# EAGLE schematic board (EAGLE 6.4)
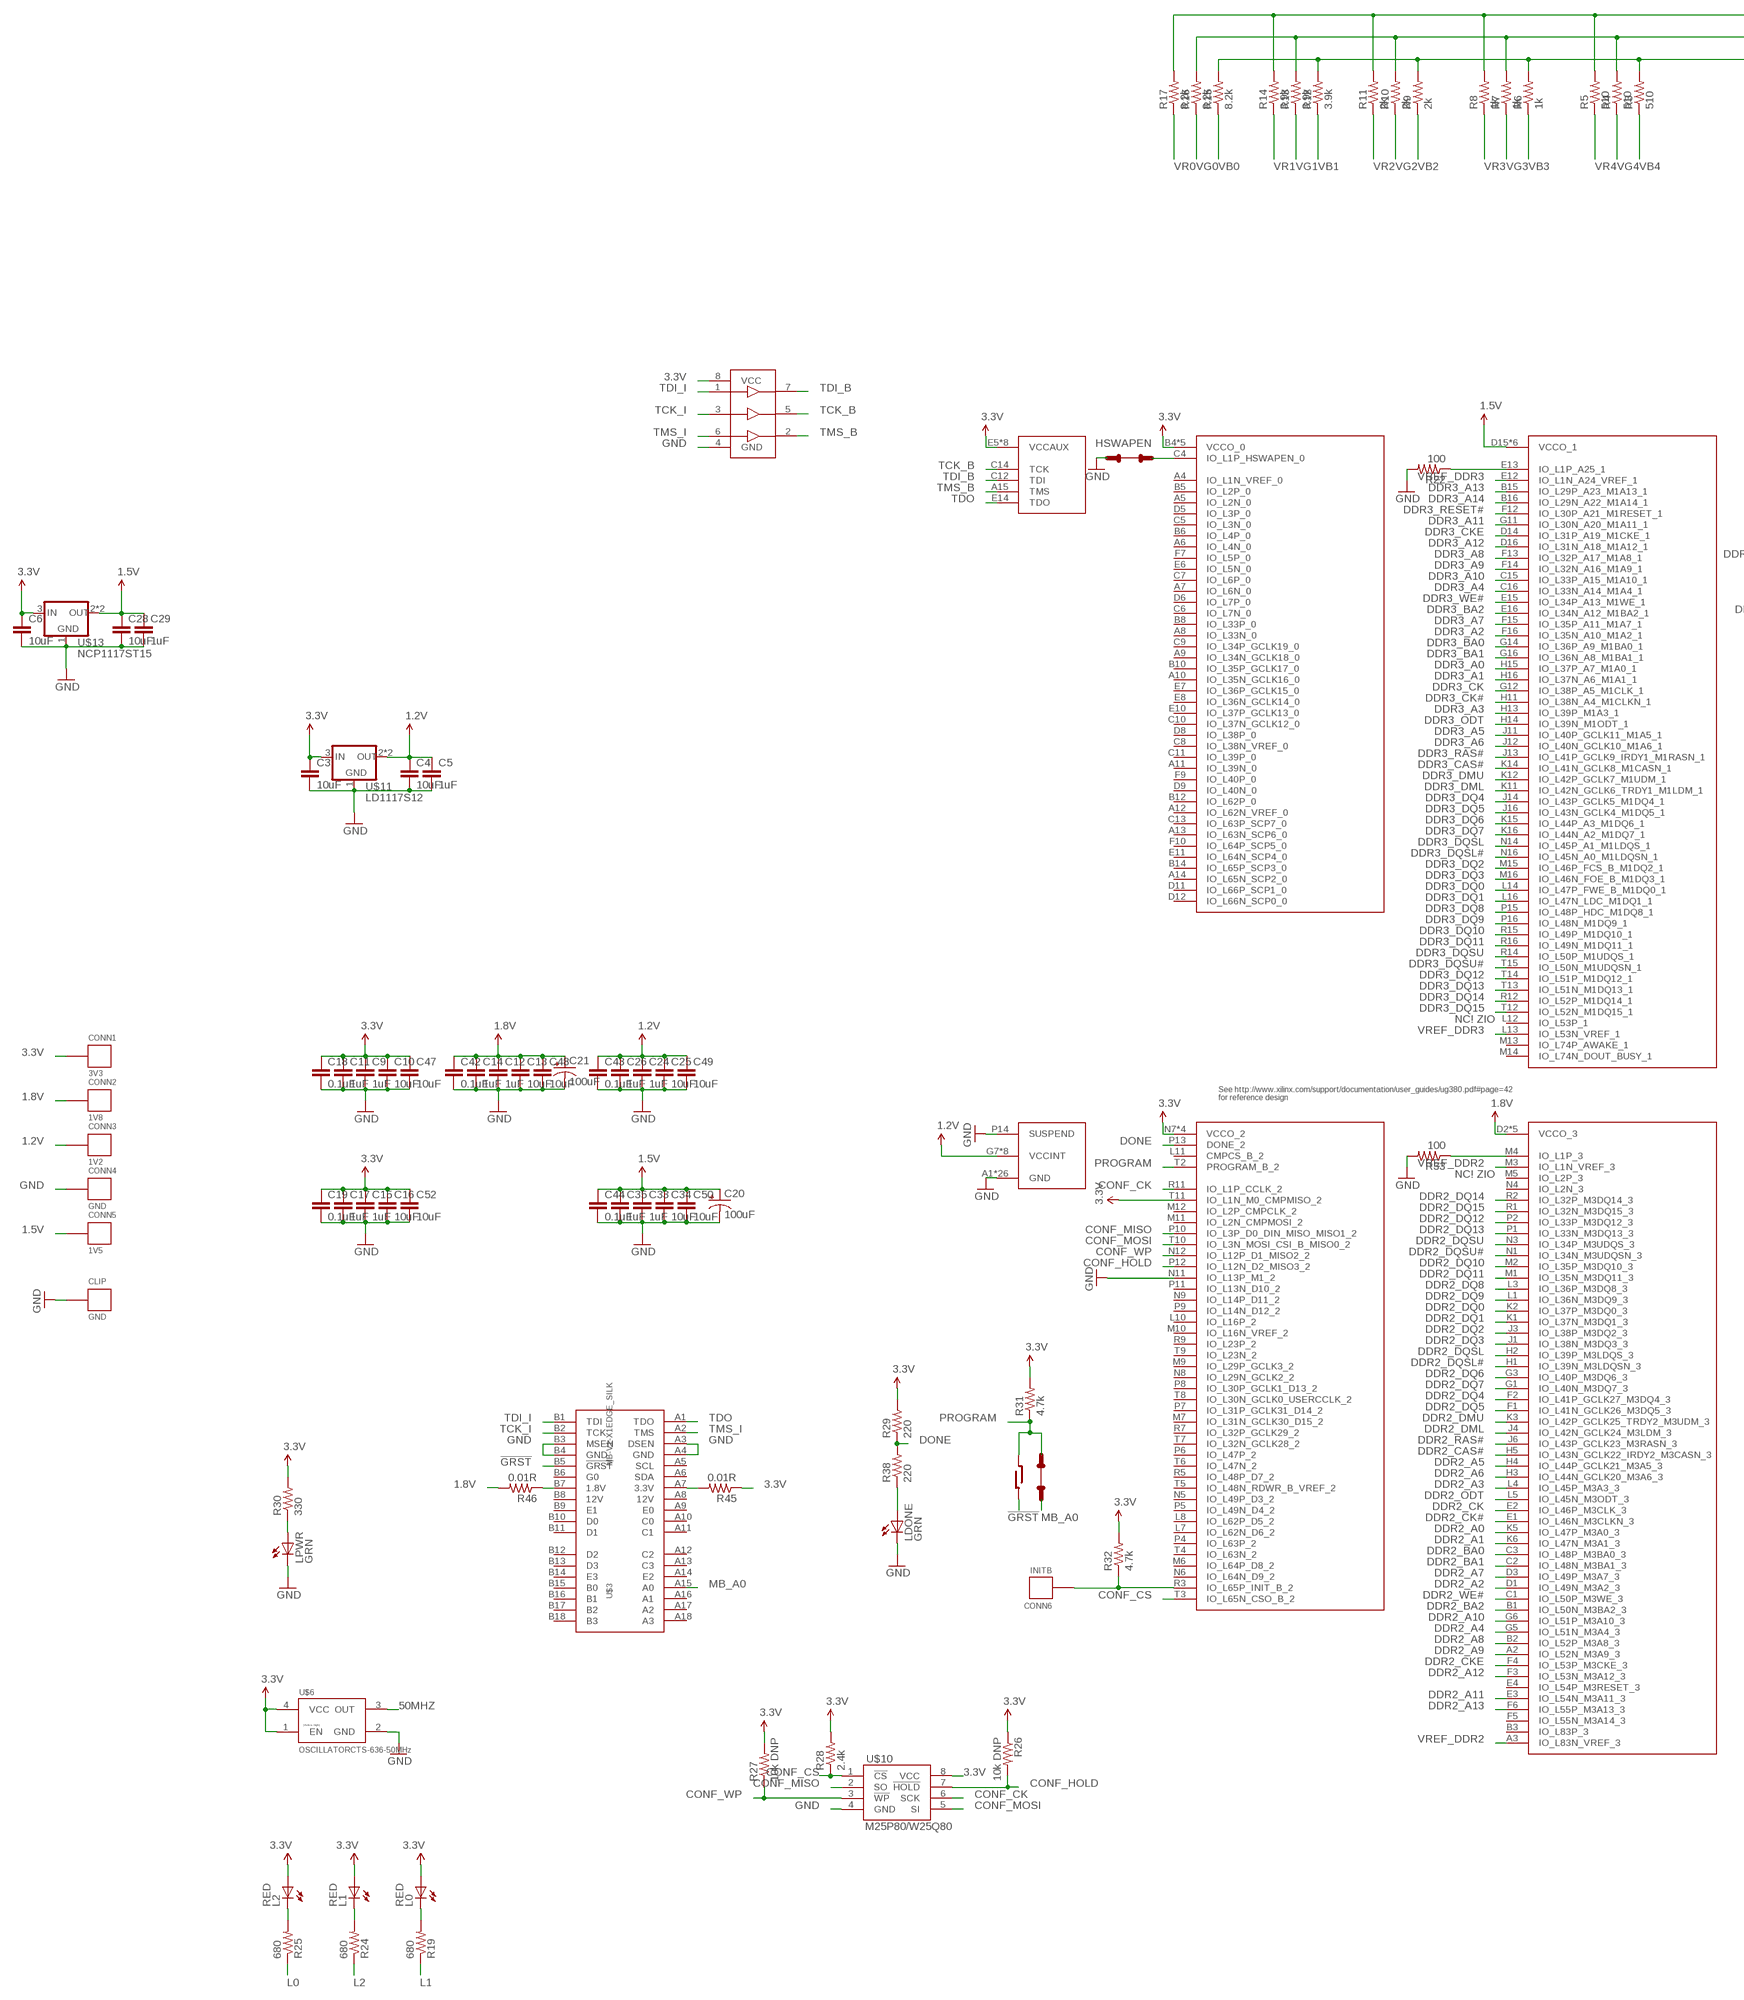
[diagram p0: schematic, sheet 1, part 1 of 2]
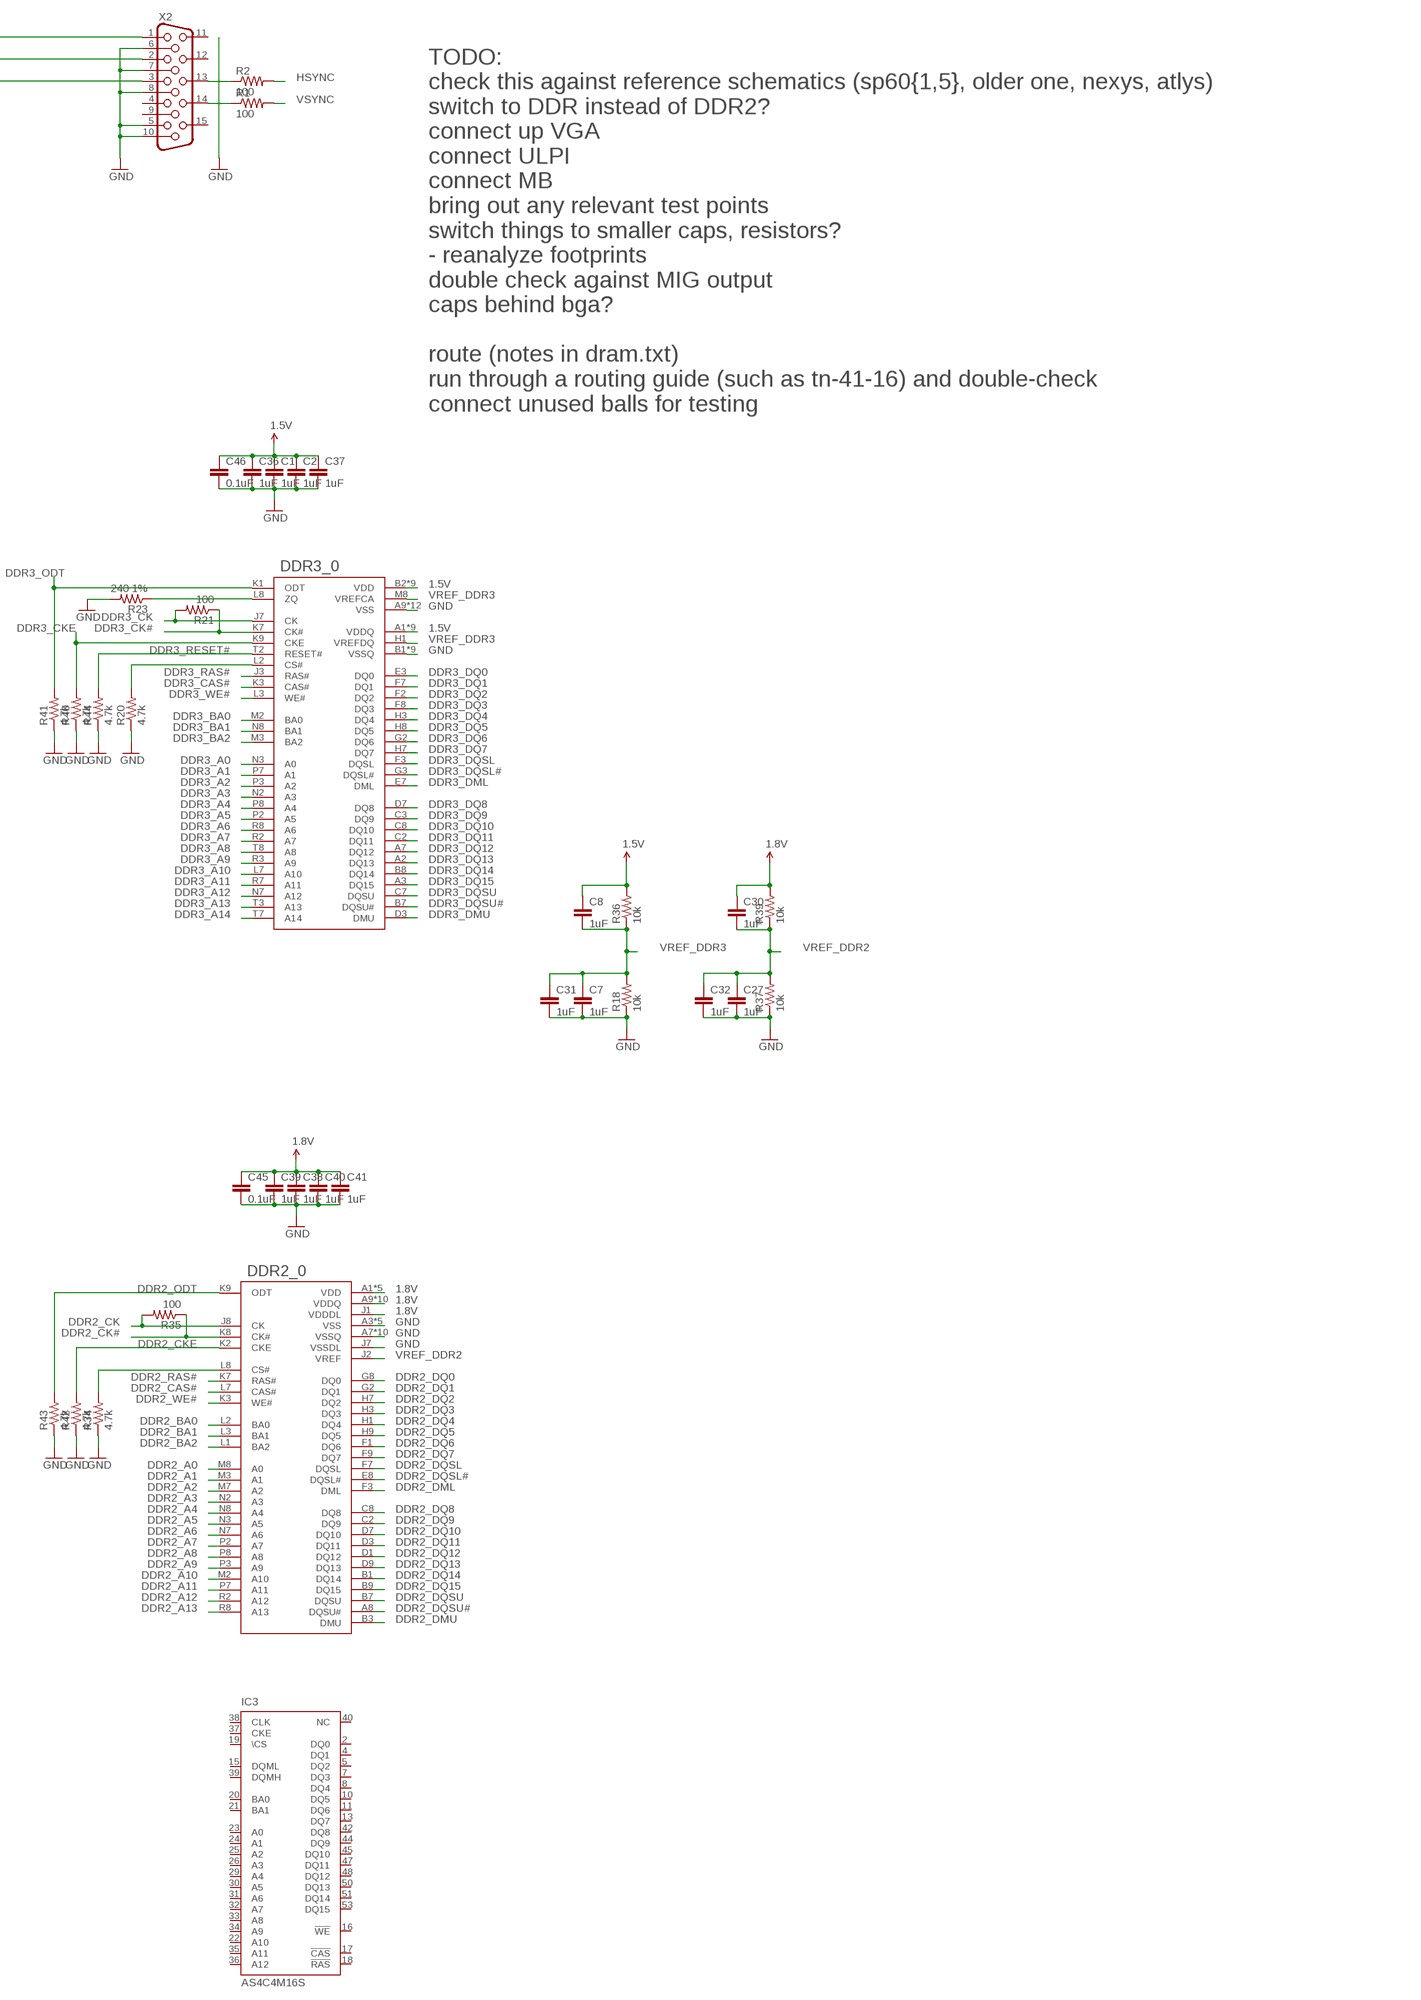
[diagram p1: schematic, sheet 1, part 2 of 2]

## Parts
C1  1uF  CAP0402-CAP  [0402-CAP]
C2  1uF  CAP0402-CAP  [0402-CAP]
C3  10uF  CAP0603  [0603-CAP]
C4  10uF  CAP0603  [0603-CAP]
C5  1uF  CAP0402-CAP  [0402-CAP]
C6  10uF  CAP0603  [0603-CAP]
C7  1uF  CAP0402-CAP  [0402-CAP]
C8  1uF  CAP0402-CAP  [0402-CAP]
C9  1uF  CAP0402-CAP  [0402-CAP]
C10  10uF  CAP0603  [0603-CAP]
C11  1uF  CAP0402-CAP  [0402-CAP]
C12  1uF  CAP0402-CAP  [0402-CAP]
C13  10uF  CAP0603  [0603-CAP]
C14  1uF  CAP0402-CAP  [0402-CAP]
C15  1uF  CAP0402-CAP  [0402-CAP]
C16  10uF  CAP0603  [0603-CAP]
C17  1uF  CAP0402-CAP  [0402-CAP]
C18  0.1uF  CAP0201  [C0201]
C19  0.1uF  CAP0201  [C0201]
C20  100uF  CAP_POLPTH-5-2  [CAP-5-2]
C21  100uF  CAP_POLPTH-5-2  [CAP-5-2]
C24  1uF  CAP0402-CAP  [0402-CAP]
C25  10uF  CAP0603  [0603-CAP]
C26  1uF  CAP0402-CAP  [0402-CAP]
C27  1uF  CAP0402-CAP  [0402-CAP]
C28  10uF  CAP0603  [0603-CAP]
C29  1uF  CAP0402-CAP  [0402-CAP]
C30  1uF  CAP0402-CAP  [0402-CAP]
C31  1uF  CAP0402-CAP  [0402-CAP]
C32  1uF  CAP0402-CAP  [0402-CAP]
C33  1uF  CAP0402-CAP  [0402-CAP]
C34  10uF  CAP0603  [0603-CAP]
C35  1uF  CAP0402-CAP  [0402-CAP]
C36  1uF  CAP0402-CAP  [0402-CAP]
C37  1uF  CAP0402-CAP  [0402-CAP]
C38  1uF  CAP0402-CAP  [0402-CAP]
C39  1uF  CAP0402-CAP  [0402-CAP]
C40  1uF  CAP0402-CAP  [0402-CAP]
C41  1uF  CAP0402-CAP  [0402-CAP]
C42  0.1uF  CAP0201  [C0201]
C43  0.1uF  CAP0201  [C0201]
C44  0.1uF  CAP0201  [C0201]
C45  0.1uF  CAP0201  [C0201]
C46  0.1uF  CAP0201  [C0201]
C47  10uF  CAP0603  [0603-CAP]
C48  10uF  CAP0603  [0603-CAP]
C49  10uF  CAP0603  [0603-CAP]
C50  10uF  CAP0603  [0603-CAP]
C52  10uF  CAP0603  [0603-CAP]
CLIP  GND  CONNECTORCLIP  [CLIP-AREA]
CONN1  3V3  CONNECTOR22AWG  [HOLE_22AWG]
CONN2  1V8  CONNECTOR22AWG  [HOLE_22AWG]
CONN3  1V2  CONNECTOR22AWG  [HOLE_22AWG]
CONN4  GND  CONNECTOR22AWG  [HOLE_22AWG]
CONN5  1V5  CONNECTOR22AWG  [HOLE_22AWG]
CONN6  INITB  CONNECTOR1.27  [TESTPAD-1.27]
DDR2_0  DDR2X16  [BGA84]
DDR3_0  DDR3X16  [BGA96]
IC1  XC6S{9,16,25}LX-FT256  [XILINX_FT256]
IC2  74X3G34  [TSSOP8]
IC3  AS4C4M16S  MT48LC64M4A2  [TSOP54-400]
L0  RED  LED0603  [0603_LED]
L1  RED  LED0603  [0603_LED]
L2  RED  LED0603  [0603_LED]
LDONE  GRN  LED0603  [0603_LED]
LPWR  GRN  LED0603  [0603_LED]
R1  100  RESISTOR0603  [0603-RES]
R2  100  RESISTOR0603  [0603-RES]
R3  510  RESISTOR0603  [0603-RES]
R4  510  RESISTOR0603  [0603-RES]
R5  510  RESISTOR0603  [0603-RES]
R6  1k  RESISTOR0603  [0603-RES]
R7  1k  RESISTOR0603  [0603-RES]
R8  1k  RESISTOR0603  [0603-RES]
R9  2k  RESISTOR0603  [0603-RES]
R10  2k  RESISTOR0603  [0603-RES]
R11  2k  RESISTOR0603  [0603-RES]
R12  3.9k  RESISTOR0603  [0603-RES]
R13  3.9k  RESISTOR0603  [0603-RES]
R14  3.9k  RESISTOR0603  [0603-RES]
R15  8.2k  RESISTOR0603  [0603-RES]
R16  8.2k  RESISTOR0603  [0603-RES]
R17  8.2k  RESISTOR0603  [0603-RES]
R18  10k  RESISTOR0603  [0603-RES]
R19  680  RESISTOR0603  [0603-RES]
R20  4.7k  RESISTOR0402  [0402-RES]
R21  100  RESISTOR0603  [0603-RES]
R22  100  RESISTOR0603  [0603-RES]
R23  240 1%  RESISTOR0603  [0603-RES]
R24  680  RESISTOR0603  [0603-RES]
R25  680  RESISTOR0603  [0603-RES]
R26  10k DNP  RESISTOR0402  [0402-RES]
R27  10k DNP  RESISTOR0402  [0402-RES]
R28  2.4k  RESISTOR0603  [0603-RES]
R29  220  RESISTOR0603  [0603-RES]
R30  330  RESISTOR0603  [0603-RES]
R31  4.7k  RESISTOR0603  [0603-RES]
R32  4.7k  RESISTOR0603  [0603-RES]
R33  100  RESISTOR0603  [0603-RES]
R34  4.7k  RESISTOR0402  [0402-RES]
R35  100  RESISTOR0603  [0603-RES]
R36  10k  RESISTOR0603  [0603-RES]
R37  10k  RESISTOR0603  [0603-RES]
R38  220  RESISTOR0603  [0603-RES]
R39  10k  RESISTOR0603  [0603-RES]
R40  4.7k  RESISTOR0402  [0402-RES]
R41  4.7k  RESISTOR0402  [0402-RES]
R42  4.7k  RESISTOR0402  [0402-RES]
R43  4.7k  RESISTOR0402  [0402-RES]
R44  4.7k  RESISTOR0402  [0402-RES]
R45  0.01R  RESISTOR0603  [0603-RES]
R46  0.01R  RESISTOR0603  [0603-RES]
SB1  SOLDER-BRIDGEOPEN  [SOLDER-BRIDGE-OPEN]
SB2  TRACE-CUT  [TRACE-CUT]
SB5  TRACE-CUT  [TRACE-CUT]
U$3  MB-V1-X1EDGE_SILK  [MB-V1-X1-EDGE]
U$6  OSCILLATORCTS-636-50MHz  OSCILLATORCTS-636  [CTS-636]
U$10  M25P80/W25Q80  S25FL  [SO08]
U$11  LD1117S12  VREGSOT223  [SOT223]
U$13  NCP1117ST15  VREGSOT223  [SOT223]
X2  HF15H  [HDF15H]

## Nets
1.2V: C4.1 C5.1 C24.1 C25.1 C26.1 C43.1 C49.1 CONN3.P IC1.G7(VCCINT) IC1.G9(VCCINT) IC1.H8(VCCINT) IC1.H10(VCCINT) IC1.J7(VCCINT) IC1.J9(VCCINT) IC1.K8(VCCINT) IC1.K10(VCCINT) U$11.2(OUT) U$11.4(OUT)
1.5V: C1.1 C2.1 C8.1 C20.1(+) C28.1 C29.1 C33.1 C34.1 C35.1 C36.1 C37.1 C44.1 C46.1 C50.1 CONN5.P DDR3_0.A1(VDDQ) DDR3_0.A8(VDDQ) DDR3_0.B2(VDD) DDR3_0.C1(VDDQ) DDR3_0.C9(VDDQ) DDR3_0.D2(VDDQ) DDR3_0.D9(VDD) DDR3_0.E9(VDDQ) DDR3_0.F1(VDDQ) DDR3_0.G7(VDD) DDR3_0.H2(VDDQ) DDR3_0.H9(VDDQ) DDR3_0.K2(VDD) DDR3_0.K8(VDD) DDR3_0.N1(VDD) DDR3_0.N9(VDD) DDR3_0.R1(VDD) DDR3_0.R9(VDD) IC1.D15(VCCO_1) IC1.G13(VCCO_1) IC1.J15(VCCO_1) IC1.K13(VCCO_1) IC1.N15(VCCO_1) IC1.R13(VCCO_1) R36.2 U$13.2(OUT) U$13.4(OUT)
1.8V: C12.1 C13.1 C14.1 C21.1(+) C30.1 C38.1 C39.1 C40.1 C41.1 C42.1 C45.1 C48.1 CONN2.P DDR2_0.A1(VDD) DDR2_0.A9(VDDQ) DDR2_0.C1(VDDQ) DDR2_0.C3(VDDQ) DDR2_0.C7(VDDQ) DDR2_0.C9(VDDQ) DDR2_0.E1(VDD) DDR2_0.E9(VDDQ) DDR2_0.G1(VDDQ) DDR2_0.G3(VDDQ) DDR2_0.G7(VDDQ) DDR2_0.G9(VDDQ) DDR2_0.J1(VDDDL) DDR2_0.J9(VDD) DDR2_0.M9(VDD) DDR2_0.R1(VDD) IC1.D2(VCCO_3) IC1.G4(VCCO_3) IC1.J2(VCCO_3) IC1.K4(VCCO_3) IC1.N2(VCCO_3) R39.2 R46.2
3.3V: C3.1 C6.1 C9.1 C10.1 C11.1 C15.1 C16.1 C17.1 C18.1 C19.1 C47.1 C52.1 CONN1.P IC1.B4(VCCO_0) IC1.B9(VCCO_0) IC1.B13(VCCO_0) IC1.D7(VCCO_0) IC1.D10(VCCO_0) IC1.E5(VCCAUX) IC1.F8(VCCAUX) IC1.F11(VCCAUX) IC1.G10(VCCAUX) IC1.H6(VCCAUX) IC1.J10(VCCAUX) IC1.L6(VCCAUX) IC1.L9(VCCAUX) IC1.N7(VCCO_2) IC1.N10(VCCO_2) IC1.R4(VCCO_2) IC1.R8(VCCO_2) IC1.T11(IO_L1N_M0_CMPMISO_2) IC2.8(VCC) L0.A L1.A L2.A R26.1 R27.2 R28.2 R29.2 R30.2 R31.2 R32.2 R45.1 U$6.1(EN) U$6.4(VCC) U$10.8(VCC) U$11.3(IN) U$13.3(IN)
50MHZ: U$6.3(OUT)
!GRST: SB1.L1 SB1.L2 U$3.B5(!GRST)
CONF_CK: IC1.R11(IO_L1P_CCLK_2) U$10.6(SCK)
CONF_CS: IC1.T3(IO_L65N_CSO_B_2) R28.1 U$10.1(!CS)
CONF_HOLD: IC1.P12(IO_L12N_D2_MISO3_2) R26.2 U$10.7(!HOLD)
CONF_MISO: IC1.P10(IO_L3P_D0_DIN_MISO_MISO1_2) U$10.2(SO)
CONF_MOSI: IC1.T10(IO_L3N_MOSI_CSI_B_MISO0_2) U$10.5(SI)
CONF_WP: IC1.N12(IO_L12P_D1_MISO2_2) R27.1 U$10.3(!WP)
DDR2_A0: DDR2_0.M8(A0) IC1.K5(IO_L47P_M3A0_3)
DDR2_A1: DDR2_0.M3(A1) IC1.K6(IO_L47N_M3A1_3)
DDR2_A2: DDR2_0.M7(A2) IC1.D1(IO_L49N_M3A2_3)
DDR2_A3: DDR2_0.N2(A3) IC1.L4(IO_L45P_M3A3_3)
DDR2_A4: DDR2_0.N8(A4) IC1.G5(IO_L51N_M3A4_3)
DDR2_A5: DDR2_0.N3(A5) IC1.H4(IO_L44P_GCLK21_M3A5_3)
DDR2_A6: DDR2_0.N7(A6) IC1.H3(IO_L44N_GCLK20_M3A6_3)
DDR2_A7: DDR2_0.P2(A7) IC1.D3(IO_L49P_M3A7_3)
DDR2_A8: DDR2_0.P8(A8) IC1.B2(IO_L52P_M3A8_3)
DDR2_A9: DDR2_0.P3(A9) IC1.A2(IO_L52N_M3A9_3)
DDR2_A10: DDR2_0.M2(A10) IC1.G6(IO_L51P_M3A10_3)
DDR2_A11: DDR2_0.P7(A11) IC1.E3(IO_L54N_M3A11_3)
DDR2_A12: DDR2_0.R2(A12) IC1.F3(IO_L53N_M3A12_3)
DDR2_A13: DDR2_0.R8(A13) IC1.F6(IO_L55P_M3A13_3)
DDR2_BA0: DDR2_0.L2(BA0) IC1.C3(IO_L48P_M3BA0_3)
DDR2_BA1: DDR2_0.L3(BA1) IC1.C2(IO_L48N_M3BA1_3)
DDR2_BA2: DDR2_0.L1(BA2) IC1.B1(IO_L50N_M3BA2_3)
DDR2_CAS#: DDR2_0.L7(CAS#) IC1.H5(IO_L43N_GCLK22_IRDY2_M3CASN_3)
DDR2_CK: DDR2_0.J8(CK) IC1.E2(IO_L46P_M3CLK_3) R35.2
DDR2_CK#: DDR2_0.K8(CK#) IC1.E1(IO_L46N_M3CLKN_3) R35.1
DDR2_CKE: DDR2_0.K2(CKE) IC1.F4(IO_L53P_M3CKE_3) R42.2
DDR2_DML: DDR2_0.F3(DML) IC1.J4(IO_L42N_GCLK24_M3LDM_3)
DDR2_DMU: DDR2_0.B3(DMU) IC1.K3(IO_L42P_GCLK25_TRDY2_M3UDM_3)
DDR2_DQ0: DDR2_0.G8(DQ0) IC1.K2(IO_L37P_M3DQ0_3)
DDR2_DQ1: DDR2_0.G2(DQ1) IC1.K1(IO_L37N_M3DQ1_3)
DDR2_DQ2: DDR2_0.H7(DQ2) IC1.J3(IO_L38P_M3DQ2_3)
DDR2_DQ3: DDR2_0.H3(DQ3) IC1.J1(IO_L38N_M3DQ3_3)
DDR2_DQ4: DDR2_0.H1(DQ4) IC1.F2(IO_L41P_GCLK27_M3DQ4_3)
DDR2_DQ5: DDR2_0.H9(DQ5) IC1.F1(IO_L41N_GCLK26_M3DQ5_3)
DDR2_DQ6: DDR2_0.F1(DQ6) IC1.G3(IO_L40P_M3DQ6_3)
DDR2_DQ7: DDR2_0.F9(DQ7) IC1.G1(IO_L40N_M3DQ7_3)
DDR2_DQ8: DDR2_0.C8(DQ8) IC1.L3(IO_L36P_M3DQ8_3)
DDR2_DQ9: DDR2_0.C2(DQ9) IC1.L1(IO_L36N_M3DQ9_3)
DDR2_DQ10: DDR2_0.D7(DQ10) IC1.M2(IO_L35P_M3DQ10_3)
DDR2_DQ11: DDR2_0.D3(DQ11) IC1.M1(IO_L35N_M3DQ11_3)
DDR2_DQ12: DDR2_0.D1(DQ12) IC1.P2(IO_L33P_M3DQ12_3)
DDR2_DQ13: DDR2_0.D9(DQ13) IC1.P1(IO_L33N_M3DQ13_3)
DDR2_DQ14: DDR2_0.B1(DQ14) IC1.R2(IO_L32P_M3DQ14_3)
DDR2_DQ15: DDR2_0.B9(DQ15) IC1.R1(IO_L32N_M3DQ15_3)
DDR2_DQSL: DDR2_0.F7(DQSL) IC1.H2(IO_L39P_M3LDQS_3)
DDR2_DQSL#: DDR2_0.E8(DQSL#) IC1.H1(IO_L39N_M3LDQSN_3)
DDR2_DQSU: DDR2_0.B7(DQSU) IC1.N3(IO_L34P_M3UDQS_3)
DDR2_DQSU#: DDR2_0.A8(DQSU#) IC1.N1(IO_L34N_M3UDQSN_3)
DDR2_ODT: DDR2_0.K9(ODT) IC1.L5(IO_L45N_M3ODT_3) R43.2
DDR2_RAS#: DDR2_0.K7(RAS#) IC1.J6(IO_L43P_GCLK23_M3RASN_3)
DDR2_WE#: DDR2_0.K3(WE#) IC1.C1(IO_L50P_M3WE_3)
DDR3_A0: DDR3_0.N3(A0) IC1.H15(IO_L37P_A7_M1A0_1)
DDR3_A1: DDR3_0.P7(A1) IC1.H16(IO_L37N_A6_M1A1_1)
DDR3_A2: DDR3_0.P3(A2) IC1.F16(IO_L35N_A10_M1A2_1)
DDR3_A3: DDR3_0.N2(A3) IC1.H13(IO_L39P_M1A3_1)
DDR3_A4: DDR3_0.P8(A4) IC1.C16(IO_L33N_A14_M1A4_1)
DDR3_A5: DDR3_0.P2(A5) IC1.J11(IO_L40P_GCLK11_M1A5_1)
DDR3_A6: DDR3_0.R8(A6) IC1.J12(IO_L40N_GCLK10_M1A6_1)
DDR3_A7: DDR3_0.R2(A7) IC1.F15(IO_L35P_A11_M1A7_1)
DDR3_A8: DDR3_0.T8(A8) IC1.F13(IO_L32P_A17_M1A8_1)
DDR3_A9: DDR3_0.R3(A9) IC1.F14(IO_L32N_A16_M1A9_1)
DDR3_A10: DDR3_0.L7(A10) IC1.C15(IO_L33P_A15_M1A10_1)
DDR3_A11: DDR3_0.R7(A11) IC1.G11(IO_L30N_A20_M1A11_1)
DDR3_A12: DDR3_0.N7(A12) IC1.D16(IO_L31N_A18_M1A12_1)
DDR3_A13: DDR3_0.T3(A13) IC1.B15(IO_L29P_A23_M1A13_1)
DDR3_A14: DDR3_0.T7(A14) IC1.B16(IO_L29N_A22_M1A14_1)
DDR3_BA0: DDR3_0.M2(BA0) IC1.G14(IO_L36P_A9_M1BA0_1)
DDR3_BA1: DDR3_0.N8(BA1) IC1.G16(IO_L36N_A8_M1BA1_1)
DDR3_BA2: DDR3_0.M3(BA2) IC1.E16(IO_L34N_A12_M1BA2_1)
DDR3_CAS#: DDR3_0.K3(CAS#) IC1.K14(IO_L41N_GCLK8_M1CASN_1)
DDR3_CK: DDR3_0.J7(CK) IC1.G12(IO_L38P_A5_M1CLK_1) R21.2
DDR3_CK#: DDR3_0.K7(CK#) IC1.H11(IO_L38N_A4_M1CLKN_1) R21.1
DDR3_CKE: DDR3_0.K9(CKE) IC1.D14(IO_L31P_A19_M1CKE_1) R40.2
DDR3_DML: DDR3_0.E7(DML) IC1.K11(IO_L42N_GCLK6_TRDY1_M1LDM_1)
DDR3_DMU: DDR3_0.D3(DMU) IC1.K12(IO_L42P_GCLK7_M1UDM_1)
DDR3_DQ0: DDR3_0.E3(DQ0) IC1.L14(IO_L47P_FWE_B_M1DQ0_1)
DDR3_DQ1: DDR3_0.F7(DQ1) IC1.L16(IO_L47N_LDC_M1DQ1_1)
DDR3_DQ2: DDR3_0.F2(DQ2) IC1.M15(IO_L46P_FCS_B_M1DQ2_1)
DDR3_DQ3: DDR3_0.F8(DQ3) IC1.M16(IO_L46N_FOE_B_M1DQ3_1)
DDR3_DQ4: DDR3_0.H3(DQ4) IC1.J14(IO_L43P_GCLK5_M1DQ4_1)
DDR3_DQ5: DDR3_0.H8(DQ5) IC1.J16(IO_L43N_GCLK4_M1DQ5_1)
DDR3_DQ6: DDR3_0.G2(DQ6) IC1.K15(IO_L44P_A3_M1DQ6_1)
DDR3_DQ7: DDR3_0.H7(DQ7) IC1.K16(IO_L44N_A2_M1DQ7_1)
DDR3_DQ8: DDR3_0.D7(DQ8) IC1.P15(IO_L48P_HDC_M1DQ8_1)
DDR3_DQ9: DDR3_0.C3(DQ9) IC1.P16(IO_L48N_M1DQ9_1)
DDR3_DQ10: DDR3_0.C8(DQ10) IC1.R15(IO_L49P_M1DQ10_1)
DDR3_DQ11: DDR3_0.C2(DQ11) IC1.R16(IO_L49N_M1DQ11_1)
DDR3_DQ12: DDR3_0.A7(DQ12) IC1.T14(IO_L51P_M1DQ12_1)
DDR3_DQ13: DDR3_0.A2(DQ13) IC1.T13(IO_L51N_M1DQ13_1)
DDR3_DQ14: DDR3_0.B8(DQ14) IC1.R12(IO_L52P_M1DQ14_1)
DDR3_DQ15: DDR3_0.A3(DQ15) IC1.T12(IO_L52N_M1DQ15_1)
DDR3_DQSL: DDR3_0.F3(DQSL) IC1.N14(IO_L45P_A1_M1LDQS_1)
DDR3_DQSL#: DDR3_0.G3(DQSL#) IC1.N16(IO_L45N_A0_M1LDQSN_1)
DDR3_DQSU: DDR3_0.C7(DQSU) IC1.R14(IO_L50P_M1UDQS_1)
DDR3_DQSU#: DDR3_0.B7(DQSU#) IC1.T15(IO_L50N_M1UDQSN_1)
DDR3_ODT: DDR3_0.K1(ODT) IC1.H14(IO_L39N_M1ODT_1) R41.2
DDR3_RAS#: DDR3_0.J3(RAS#) IC1.J13(IO_L41P_GCLK9_IRDY1_M1RASN_1)
DDR3_RESET#: DDR3_0.T2(RESET#) IC1.F12(IO_L30P_A21_M1RESET_1) R44.2
DDR3_WE#: DDR3_0.L3(WE#) IC1.E15(IO_L34P_A13_M1WE_1)
DONE: IC1.P13(DONE_2) R29.1 R38.2
GND: C1.2 C2.2 C3.2 C4.2 C5.2 C6.2 C7.2 C9.2 C10.2 C11.2 C12.2 C13.2 C14.2 C15.2 C16.2 C17.2 C18.2 C19.2 C20.2(-) C21.2(-) C24.2 C25.2 C26.2 C27.2 C28.2 C29.2 C31.2 C32.2 C33.2 C34.2 C35.2 C36.2 C37.2 C38.2 C39.2 C40.2 C41.2 C42.2 C43.2 C44.2 C45.2 C46.2 C47.2 C48.2 C49.2 C50.2 C52.2 CLIP.P$1(P) CLIP.P$2(P) CONN4.P DDR2_0.A3(VSS) DDR2_0.A7(VSSQ) DDR2_0.B2(VSSQ) DDR2_0.B8(VSSQ) DDR2_0.D2(VSSQ) DDR2_0.D8(VSSQ) DDR2_0.E3(VSS) DDR2_0.E7(VSSQ) DDR2_0.F2(VSSQ) DDR2_0.F8(VSSQ) DDR2_0.H2(VSSQ) DDR2_0.H8(VSSQ) DDR2_0.J3(VSS) DDR2_0.J7(VSSDL) DDR2_0.N1(VSS) DDR2_0.P9(VSS) DDR3_0.A9(VSS) DDR3_0.B1(VSSQ) DDR3_0.B3(VSS) DDR3_0.B9(VSSQ) DDR3_0.D1(VSSQ) DDR3_0.D8(VSSQ) DDR3_0.E1(VSS) DDR3_0.E2(VSSQ) DDR3_0.E8(VSSQ) DDR3_0.F9(VSSQ) DDR3_0.G1(VSSQ) DDR3_0.G8(VSS) DDR3_0.G9(VSSQ) DDR3_0.J2(VSS) DDR3_0.J8(VSS) DDR3_0.M1(VSS) DDR3_0.M9(VSS) DDR3_0.P1(VSS) DDR3_0.P9(VSS) DDR3_0.T1(VSS) DDR3_0.T9(VSS) IC1.A1(GND) IC1.A16(GND) IC1.B7(GND) IC1.B11(GND) IC1.D4(GND) IC1.D13(GND) IC1.E9(GND) IC1.G2(GND) IC1.G8(GND) IC1.G15(GND) IC1.H7(GND) IC1.H9(GND) IC1.H12(GND) IC1.J5(GND) IC1.J8(GND) IC1.K7(GND) IC1.K9(GND) IC1.L2(GND) IC1.L15(GND) IC1.M8(GND) IC1.N11(IO_L13P_M1_2) IC1.N13(GND) IC1.P3(GND) IC1.P14(SUSPEND) IC1.R6(GND) IC1.R10(GND) IC1.T1(GND) IC1.T16(GND) IC2.4(GND) LDONE.C LPWR.C R18.1 R20.1 R22.2 R23.2 R33.2 R34.1 R37.1 R40.1 R41.1 R42.1 R43.1 R44.1 SB5.R1 U$3.A3(DSEN) U$3.A4(GND) U$3.B3(MSEN) U$3.B4(GND) U$6.2(GND) U$10.4(GND) U$11.1(GND) U$13.1(GND) X2.5 X2.6 X2.7 X2.8 X2.10
HSWAPEN: IC1.C4(IO_L1P_HSWAPEN_0) SB5.L1
HSYNC: R2.2
INIT_B: CONN6.P IC1.R3(IO_L65P_INIT_B_2) R32.1
L0: R25.1
L1: R19.1
L2: R24.1
MB_A0: SB2.L1 U$3.A15(A0)
N$1: R1.1 X2.14
N$2: R2.1 X2.13
N$3: R4.2 R7.2 R10.2 R13.2 R16.2 X2.2
N$4: R5.2 R8.2 R11.2 R14.2 R17.2 X2.1
N$5: R45.2 U$3.A7(3.3V)
N$7: L0.C R19.2
N$8: L1.C R24.2
N$9: L2.C R25.2
N$10: R3.2 R6.2 R9.2 R12.2 R15.2 X2.3
N$11: IC1.E13(IO_L1P_A25_1) R22.1
N$12: DDR3_0.L8(ZQ) R23.1
N$13: DDR3_0.L2(CS#) R20.2
N$14: LPWR.A R30.1
N$15: R46.1 U$3.B7(1.8V)
N$16: LDONE.A R38.1
N$30: IC1.M4(IO_L1P_3) R33.1
N$37: DDR2_0.L8(CS#) R34.2
PROGRAM: IC1.T2(PROGRAM_B_2) R31.1 SB1.R1 SB1.R2 SB2.R1
TCK_B: IC1.C14(TCK) IC2.5(2Y)
TCK_I: IC2.3(2A) U$3.B2(TCK)
TDI_B: IC1.C12(TDI) IC2.7(1Y)
TDI_I: IC2.1(1A) U$3.B1(TDI)
TDO: IC1.E14(TDO) U$3.A1(TDO)
TMS_B: IC1.A15(TMS) IC2.2(3Y)
TMS_I: IC2.6(3A) U$3.A2(TMS)
VB0: R15.1
VB1: R12.1
VB2: R9.1
VB3: R6.1
VB4: R3.1
VG0: R16.1
VG1: R13.1
VG2: R10.1
VG3: R7.1
VG4: R4.1
VR0: R17.1
VR1: R14.1
VR2: R11.1
VR3: R8.1
VR4: R5.1
VREF_DDR2: C27.1 C30.2 C32.1 DDR2_0.J2(VREF) IC1.A3(IO_L83N_VREF_3) IC1.M3(IO_L1N_VREF_3) R37.2 R39.1
VREF_DDR3: C7.1 C8.2 C31.1 DDR3_0.H1(VREFDQ) DDR3_0.M8(VREFCA) IC1.E12(IO_L1N_A24_VREF_1) IC1.L13(IO_L53N_VREF_1) R18.2 R36.1
VSYNC: R1.2
Unconnected: IC1.A4(IO_L1N_VREF_0) IC1.A5(IO_L2N_0) IC1.A6(IO_L4N_0) IC1.A7(IO_L6N_0) IC1.A8(IO_L33N_0) IC1.A9(IO_L34N_GCLK18_0) IC1.A10(IO_L35N_GCLK16_0) IC1.A11(IO_L39N_0) IC1.A12(IO_L62N_VREF_0) IC1.A13(IO_L63N_SCP6_0) IC1.A14(IO_L65N_SCP2_0) IC1.B3(IO_L83P_3) IC1.B5(IO_L2P_0) IC1.B6(IO_L4P_0) IC1.B8(IO_L33P_0) IC1.B10(IO_L35P_GCLK17_0) IC1.B12(IO_L62P_0) IC1.B14(IO_L65P_SCP3_0) IC1.C5(IO_L3N_0) IC1.C6(IO_L7N_0) IC1.C7(IO_L6P_0) IC1.C8(IO_L38N_VREF_0) IC1.C9(IO_L34P_GCLK19_0) IC1.C10(IO_L37N_GCLK12_0) IC1.C11(IO_L39P_0) IC1.C13(IO_L63P_SCP7_0) IC1.D5(IO_L3P_0) IC1.D6(IO_L7P_0) IC1.D8(IO_L38P_0) IC1.D9(IO_L40N_0) IC1.D11(IO_L66P_SCP1_0) IC1.D12(IO_L66N_SCP0_0) IC1.E4(IO_L54P_M3RESET_3) IC1.E6(IO_L5N_0) IC1.E7(IO_L36P_GCLK15_0) IC1.E8(IO_L36N_GCLK14_0) IC1.E10(IO_L37P_GCLK13_0) IC1.E11(IO_L64N_SCP4_0) IC1.F5(IO_L55N_M3A14_3) IC1.F7(IO_L5P_0) IC1.F9(IO_L40P_0) IC1.F10(IO_L64P_SCP5_0) IC1.L7(IO_L62N_D6_2) IC1.L8(IO_L62P_D5_2) IC1.L10(IO_L16P_2) IC1.L11(CMPCS_B_2) IC1.L12(IO_L53P_1) IC1.M5(IO_L2P_3) IC1.M6(IO_L64P_D8_2) IC1.M7(IO_L31N_GCLK30_D15_2) IC1.M9(IO_L29P_GCLK3_2) IC1.M10(IO_L16N_VREF_2) IC1.M11(IO_L2N_CMPMOSI_2) IC1.M12(IO_L2P_CMPCLK_2) IC1.M13(IO_L74P_AWAKE_1) IC1.M14(IO_L74N_DOUT_BUSY_1) IC1.N4(IO_L2N_3) IC1.N5(IO_L49P_D3_2) IC1.N6(IO_L64N_D9_2) IC1.N8(IO_L29N_GCLK2_2) IC1.N9(IO_L14P_D11_2) IC1.P4(IO_L63P_2) IC1.P5(IO_L49N_D4_2) IC1.P6(IO_L47P_2) IC1.P7(IO_L31P_GCLK31_D14_2) IC1.P8(IO_L30P_GCLK1_D13_2) IC1.P9(IO_L14N_D12_2) IC1.P11(IO_L13N_D10_2) IC1.R5(IO_L48P_D7_2) IC1.R7(IO_L32P_GCLK29_2) IC1.R9(IO_L23P_2) IC1.T4(IO_L63N_2) IC1.T5(IO_L48N_RDWR_B_VREF_2) IC1.T6(IO_L47N_2) IC1.T7(IO_L32N_GCLK28_2) IC1.T8(IO_L30N_GCLK0_USERCCLK_2) IC1.T9(IO_L23N_2) IC3.1(VDD) IC3.2(DQ0) IC3.3(VDDQ) IC3.4(DQ1) IC3.5(DQ2) IC3.6(VSSQ) IC3.7(DQ3) IC3.8(DQ4) IC3.9(VDDQ) IC3.10(DQ5) IC3.11(DQ6) IC3.12(VSSQ) IC3.13(DQ7) IC3.14(VDD) IC3.15(DQML) IC3.16(!WE) IC3.17(!CAS) IC3.18(!RAS) IC3.19(\CS) IC3.20(BA0) IC3.21(BA1) IC3.22(A10) IC3.23(A0) IC3.24(A1) IC3.25(A2) IC3.26(A3) IC3.27(VDD) IC3.28(VSS) IC3.29(A4) IC3.30(A5) IC3.31(A6) IC3.32(A7) IC3.33(A8) IC3.34(A9) IC3.35(A11) IC3.36(A12) IC3.37(CKE) IC3.38(CLK) IC3.39(DQMH) IC3.40(NC) IC3.41(VSS) IC3.42(DQ8) IC3.43(VDDQ) IC3.44(DQ9) IC3.45(DQ10) IC3.46(VSSQ) IC3.47(DQ11) IC3.48(DQ12) IC3.49(VDDQ) IC3.50(DQ13) IC3.51(DQ14) IC3.52(VSSQ) IC3.53(DQ15) IC3.54(VSS) U$3.A5(SCL) U$3.A6(SDA) U$3.A8(12V) U$3.A9(E0) U$3.A10(C0) U$3.A11(C1) U$3.A12(C2) U$3.A13(C3) U$3.A14(E2) U$3.A16(A1) U$3.A17(A2) U$3.A18(A3) U$3.B6(G0) U$3.B8(12V) U$3.B9(E1) U$3.B10(D0) U$3.B11(D1) U$3.B12(D2) U$3.B13(D3) U$3.B14(E3) U$3.B15(B0) U$3.B16(B1) U$3.B17(B2) U$3.B18(B3) X2.4 X2.9 X2.11 X2.12 X2.15

## Notes on the sheet
- TODO:
  check this against reference schematics (sp60{1,5}, older one, nexys, atlys)
  switch to DDR instead of DDR2?
  connect up VGA
  connect ULPI
  connect MB
  bring out any relevant test points
  switch things to smaller caps, resistors?
  - reanalyze footprints
  double check against MIG output
  caps behind bga?
  
  route (notes in dram.txt)
  run through a routing guide (such as tn-41-16) and double-check
  connect unused balls for testing
- NC! ZIO
- See http://www.xilinx.com/support/documentation/user_guides/ug380.pdf#page=42
  for reference design
- NC! ZIO

## Library data of the parts
C1-C19 C24-C50 C52 = kmod-passives:CAP: Capacitor Standard 0603 ceramic capacitor, and 0.1" leaded capacitor.
C20 C21 = kmod-passives:CAP_POL: Capacitor Polarized These are standard SMD and PTH capacitors. Normally 10uF, 47uF, and 100uF in electrolytic and tantalum varieties. Always verify the external diameter of the through hole cap, it varies with capacity, voltage, and manufacturer. The EIA devices should be standard.
CLIP CONN1-CONN6 = kmod-nonparts:CONNECTOR: Collection of holes/pads for testing/connecting
DDR2_0 = kmod-testing:DDR2X16: DDR2 x16 Based off a 2gb part
DDR3_0 = kmod-testing:DDR3X16: DDR3 x16 Based off a 4gb part
IC1 = kmod-xilinx:XC6S{9,16,25}LX-FT256
IC2 = kmod-testing:74X3G34: Triple buffer
IC3 = memory-micron:MT48LC64M4A2: 256Mb: x16 SDRAM MT48LC64M4A2 - 16 Meg x 4 x 4 banks Source: http://download.micron.com/pdf/datasheets/dram/sdram/256MSDRAM.pdf; OC_FARNELL: unknown; OC_NEWARK: unknown
L0 L1 L2 LDONE LPWR = kmod-passives:LED
R1-R46 = kmod-passives:RESISTOR: Resistor Basic schematic elements and footprints for 0603, 1206, and PTH resistors.
SB1 = kmod-nonparts:SOLDER-BRIDGE
SB2 SB5 = kmod-nonparts:TRACE-CUT
U$3 = kmod-connectors:MB-V1-X1
U$6 = kmod-mechanical:OSCILLATOR
U$10 = kmod-ics:S25FL: Spansion S25FL* SPI flash
U$11 U$13 = kmod-ics:VREG
X2 = con-subd:HF15: SUB-D; OC_FARNELL: unknown; OC_NEWARK: unknown